# EasyEDA schematic SCH_pi-i2c-hat_2025-04-26.json
TITLE: i2c-sensor-HAT; REV: 1.0; Date: 2025-04-14; Sheet: 1/1; Drawn By: krunchiekrunch; Company: krunchiekrunch
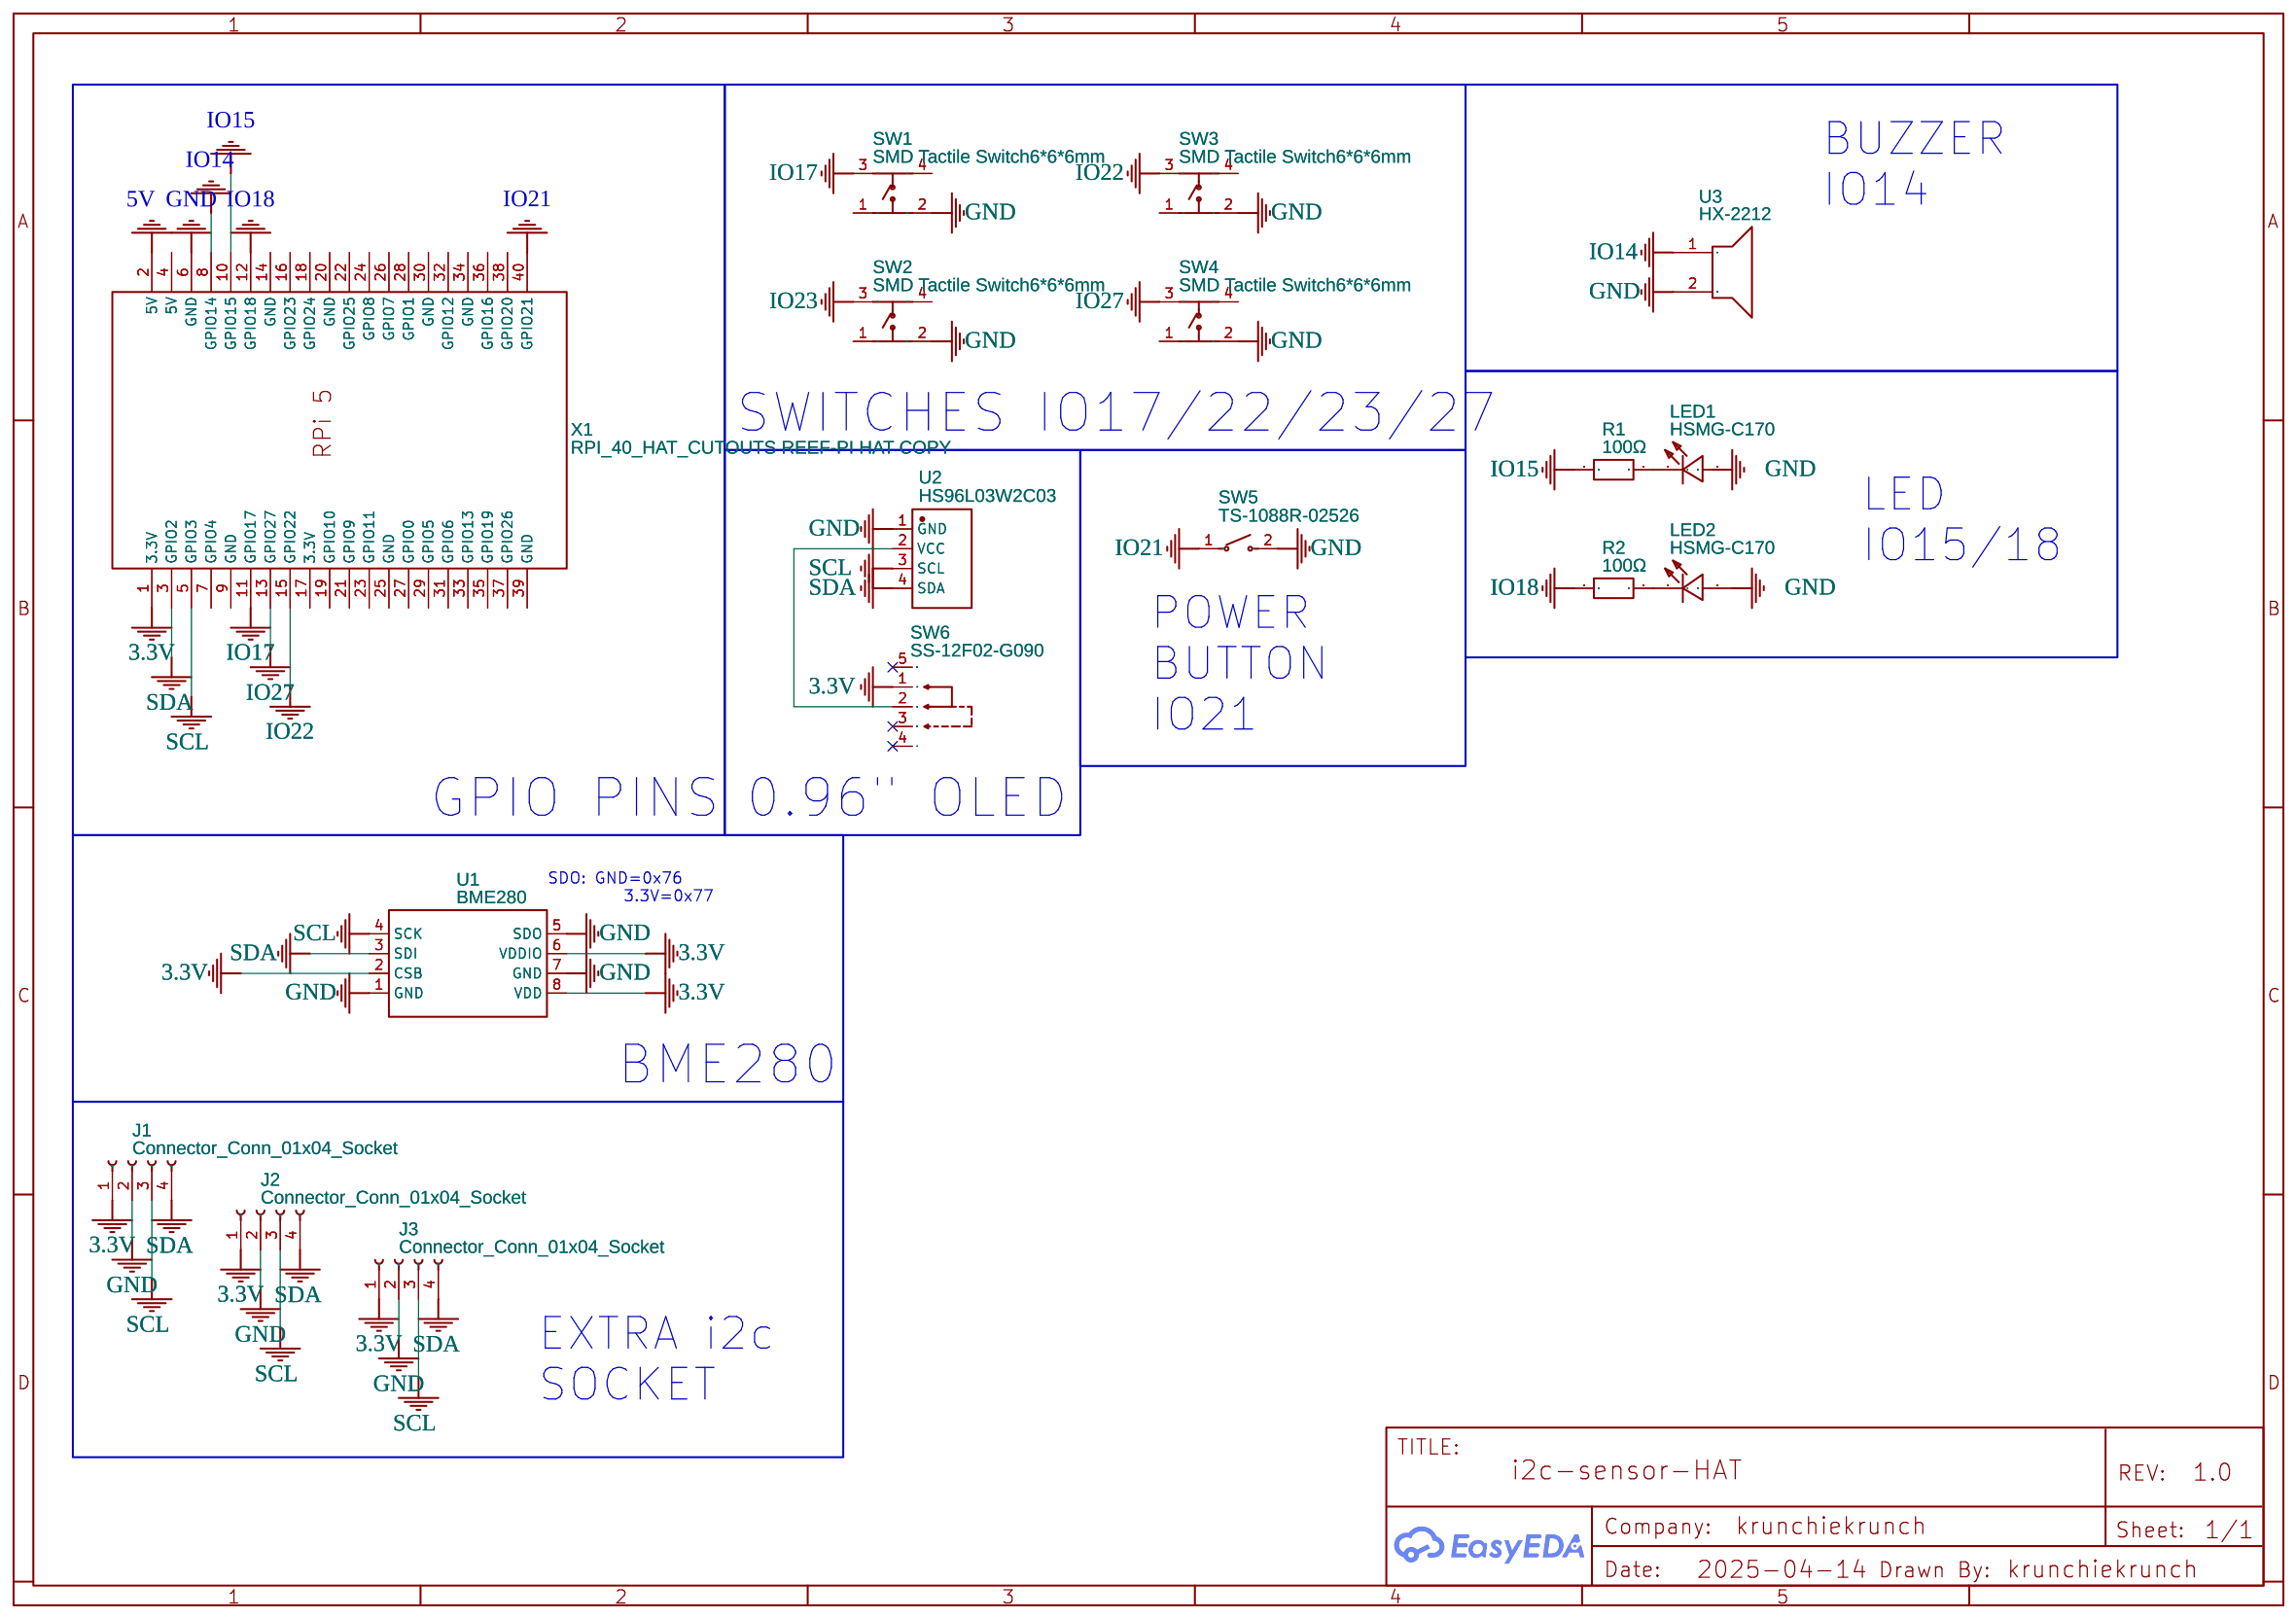
[diagram p0: schematic sheet]

## Parts
J1  Connector_Conn_01x04_Socket  [CONNECTOR_PINSOCKET_2.54MM:PINSOCKET_1X04_P2.54MM_VERTICAL]
J2  Connector_Conn_01x04_Socket  [CONNECTOR_PINSOCKET_2.54MM:PINSOCKET_1X04_P2.54MM_VERTICAL]
J3  Connector_Conn_01x04_Socket  [CONNECTOR_PINSOCKET_2.54MM:PINSOCKET_1X04_P2.54MM_VERTICAL]
LED1  HSMG-C170  [LED-SMD_L2.0-W1.25-RD-GREEN]
LED2  HSMG-C170  [LED-SMD_L2.0-W1.25-RD-GREEN]
R1  100Ω  [R0805]
R2  100Ω  [R0805]
SW1  SMD Tactile Switch6*6*6mm  [SW-SMD_4P-L6.0-W6.0-P4.50-LS9.0_C23873]
SW2  SMD Tactile Switch6*6*6mm  [SW-SMD_4P-L6.0-W6.0-P4.50-LS9.0_C23873]
SW3  SMD Tactile Switch6*6*6mm  [SW-SMD_4P-L6.0-W6.0-P4.50-LS9.0_C23873]
SW4  SMD Tactile Switch6*6*6mm  [SW-SMD_4P-L6.0-W6.0-P4.50-LS9.0_C23873]
SW5  TS-1088R-02526  [SW-SMD_L3.9-W3.0-P4.45]
SW6  SS-12F02-G090  [SW-TH_G-SWITCH_SS-12F02-G090]
U1  BME280  [LGA-8_BME280_BL]
U2  HS96L03W2C03  [OLED-TH_L27.8-W27.2-P2.54_C9900033791]
U3  HX-2212  [BUZ-TH_BD22.0-P10.00_BUZZER_PIEZO_HX-2212]
X1  RPI_40_HAT_CUTOUTS REEF-PI HAT COPY  [RPI_40_HAT_CUTOUTS REEF-PI HAT COPY]

## Library data of the parts
J1-J3 = Connector_Conn_01x04_Socket: Generic connector, single row, 01x04, script generated; Add into BOM: yes; Convert to PCB: yes; Origin Footprint: PinSocket_1x04_P2.54mm_Vertical; Contributor: ujinnnnnn
LED1 LED2 = HSMG-C170: Contributor: LCSC; Supplier: LCSC; Supplier Part: C188728; Manufacturer: Broadcom/AVAGO(安华高); JLCPCB Part Class: Extended Part
R1 R2 = TRC0805D100RP0525Z: Supplier: LCSC; Supplier Part: C3202623; Manufacturer: EVER OHMS(天二科技); Contributor: lcsc; JLCPCB Part Class: Extended Part
SW1-SW4 = SMD Tactile Switch6*6*6mm: Supplier Part: C23873; Supplier: LCSC; Manufacturer: null; Manufacturer Part: 贴片轻触开关6*6*6mm; JLCPCB Part Class: Extended Part
SW5 = TS-1088R-02526: Contributor: LCSC; Supplier: LCSC; Supplier Part: C455281; Manufacturer: XUNPU(讯普); JLCPCB Part Class: Extended Part
SW6 = SS-12F02-G090: Contributor: LCSC; Supplier: LCSC; Supplier Part: C2848916; Manufacturer: G-Switch(品赞); JLCPCB Part Class: Extended Part
U1 = BME280: Contributor: LCSC; Supplier: LCSC; Manufacturer: Bosch(博世); Supplier Part: C92489; JLCPCB Part Class: Extended Part
U2 = HS96L03W2C03: Contributor: lcsc; Supplier: LCSC; Supplier Part: C5248080; Manufacturer: HS(汉昇); JLCPCB Part Class: Extended Part
U3 = HX-2212: Contributor: lcsc; Supplier: LCSC; Supplier Part: C9900023877; Manufacturer: null; JLCPCB Part Class: Extended Part
X1 = Raspberry Pi 5: Contributor: lav4; Manufacturer: Raspberry Pi 5 4GB

## Nets
3.3V: J1.1(Pin) J2.1(Pin) J3.1(Pin) SW6.1 U1.2(CSB) U1.6(VDDIO) U1.8(VDD) X1.1(3.3V)
5V: X1.2(5V)
GND: J1.2(Pin) J2.2(Pin) J3.2(Pin) LED1.2 LED2.2 SW1.2 SW2.2 SW3.2 SW4.2 SW5.2 U1.1(GND) U1.5(SDO) U1.7(GND) U2.1(GND) U3.2 X1.6(GND)
IO14: U3.1 X1.8(GPIO14)
IO15: R1.1 X1.10(GPIO15)
IO17: SW1.3 X1.11(GPIO17)
IO18: R2.1 X1.12(GPIO18)
IO21: SW5.1 X1.40(GPIO21)
IO22: SW3.3 X1.15(GPIO22)
IO23: SW2.3
IO27: SW4.3 X1.13(GPIO27)
SCL: J1.3(Pin) J2.3(Pin) J3.3(Pin) U1.4(SCK) U2.3(SCL) X1.5(GPIO3)
SDA: J1.4(Pin) J2.4(Pin) J3.4(Pin) U1.3(SDI) U2.4(SDA) X1.3(GPIO2)
Net-(LED1-1): LED1.1 R1.2
Net-(LED2-1): LED2.1 R2.2
Net-(SW6-2): SW6.2 U2.2(VCC)

Not connected (* = marked no-connect by the designer): SW1 1 4; SW2 1 4; SW3 1 4; SW4 1 4; SW6 3* 4* 5*; X1 4(5V) 7(GPIO4) 9(GND) 14(GND) 16(GPIO23) 17(3.3V) 18(GPIO24) 19(GPIO10) 20(GND) 21(GPIO9) 22(GPIO25) 23(GPIO11) 24(GPIO8) 25(GND) 26(GPIO7) 27(GPIO0) 28(GPIO1) 29(GPIO5) 30(GND) 31(GPIO6) 32(GPIO12) 33(GPIO13) 34(GND) 35(GPIO19) 36(GPIO16) 37(GPIO26) 38(GPIO20) 39(GND)

## Notes on the sheet
- BUZZER
  IO14
- SWITCHES IO17/22/23/27
- LED
  IO15/18
- POWER
  BUTTON
  IO21
- GPIO PINS
- 0.96" OLED
- SDO: GND=0x76
           3.3V=0x77
- BME280
- EXTRA i2c
  SOCKET
